# EAGLE design GLCD_Adapter (EAGLE 6.1)
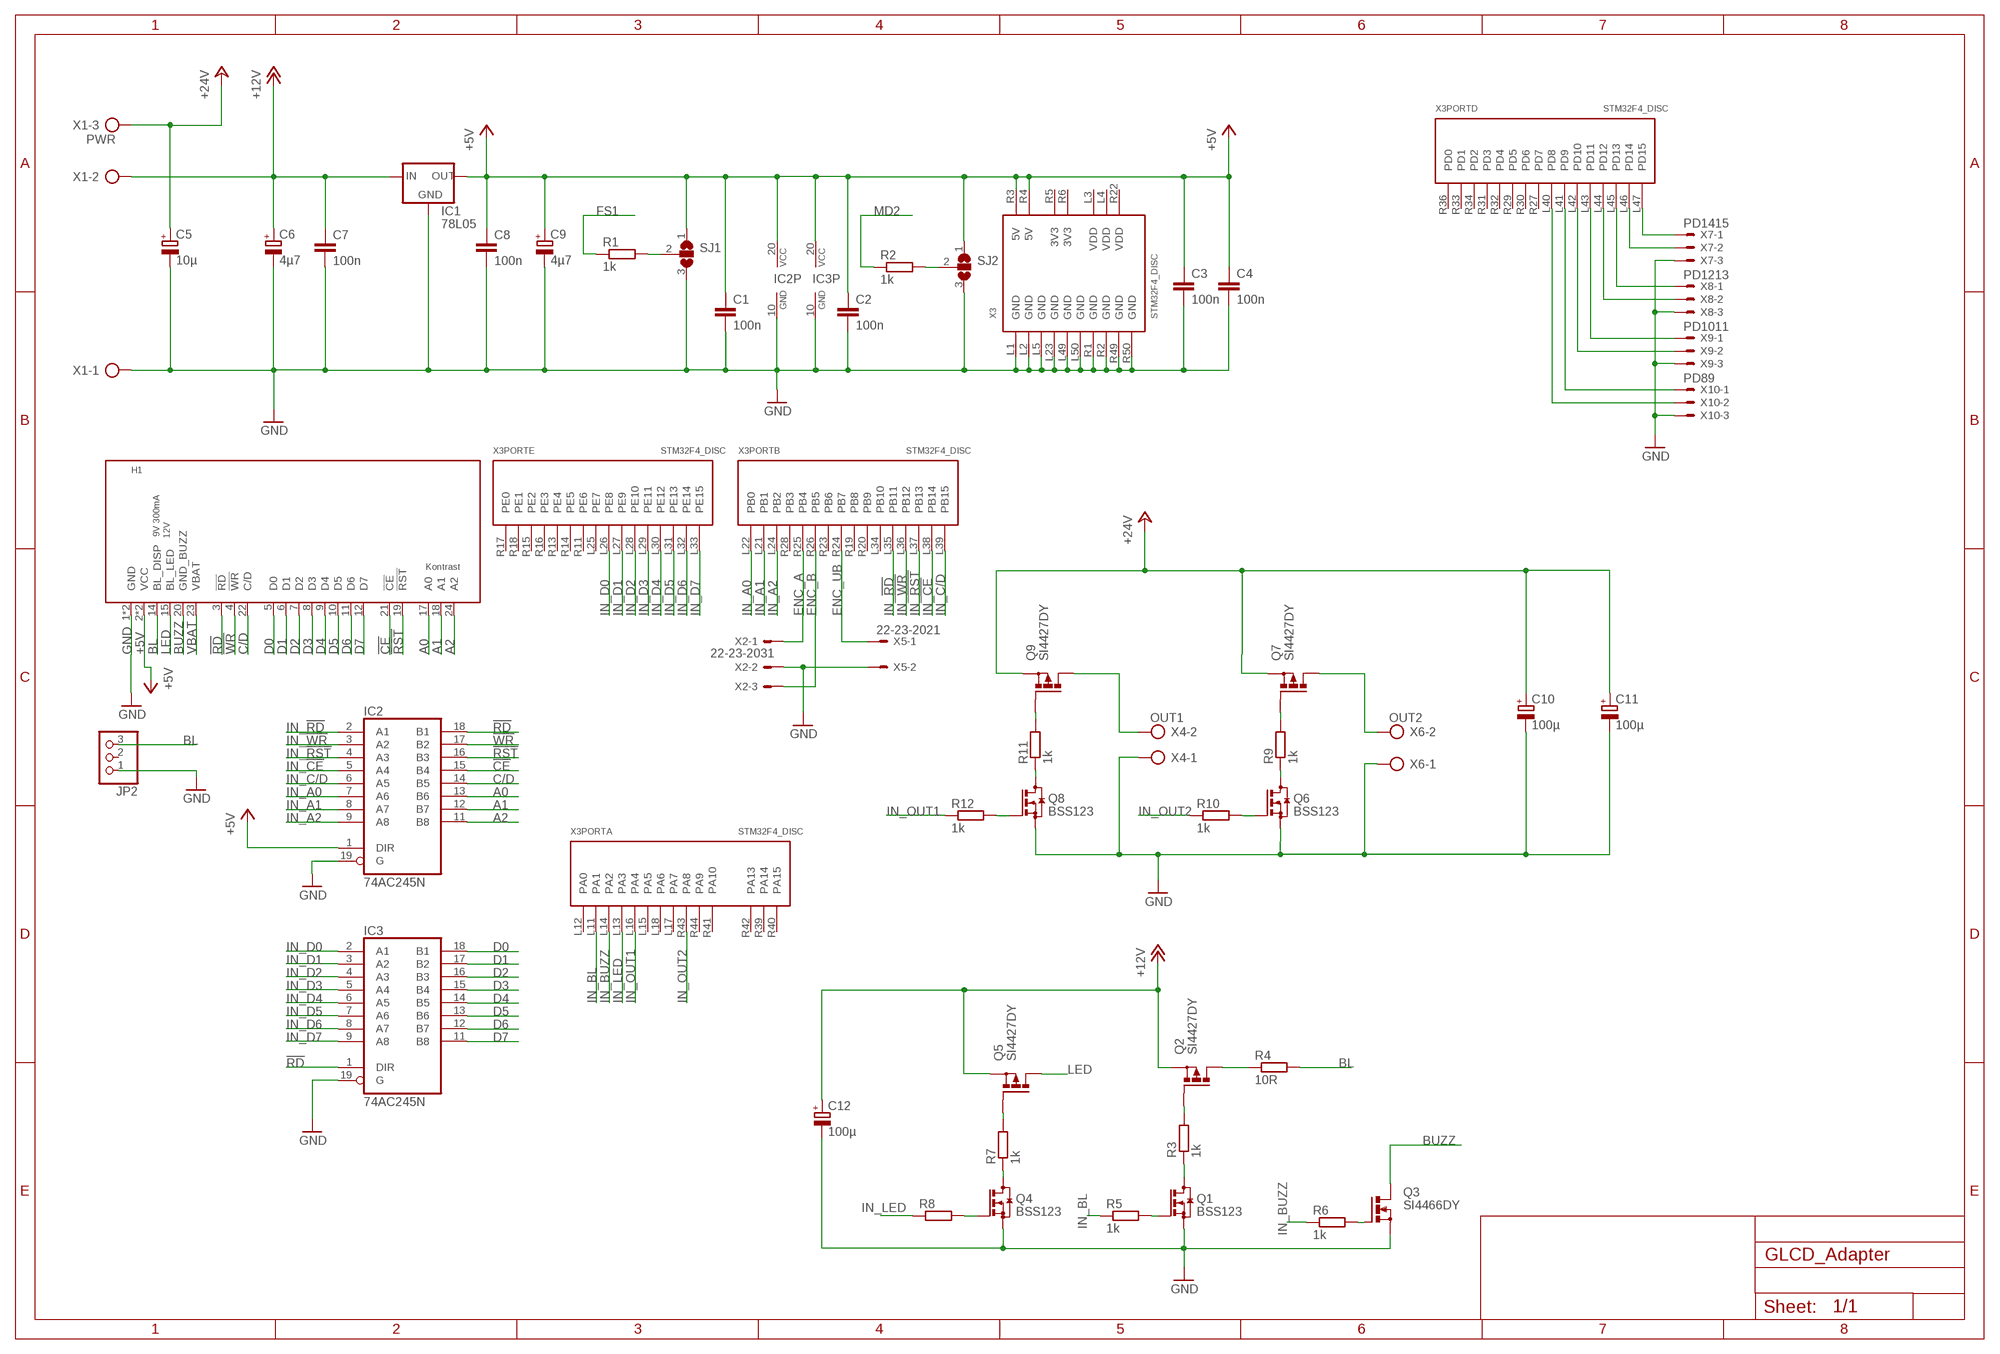
[diagram p0: schematic, sheet 1]

## Parts
C1  100n  C-EUC1206  [C1206]
C2  100n  C-EUC1206  [C1206]
C3  100n  C-EUC1206  [C1206]
C4  100n  C-EUC1206  [C1206]
C5  10µ  CPOL-EUE2-5  [E2-5]
C6  4µ7  CPOL-EUE2-5  [E2-5]
C7  100n  C-EUC1206  [C1206]
C8  100n  C-EUC1206  [C1206]
C9  4µ7  CPOL-EUE2-5  [E2-5]
C10  100µ  CPOL-EUE2-5  [E2-5]
C11  100µ  CPOL-EUE2-5  [E2-5]
C12  100µ  CPOL-EUE2-5  [E2-5]
H1  YL_24012-70-MICROMATCH  [YL24012-70-MICROMATCH]
IC1  78L05  78XXL  [78XXL]
IC2  74AC245N  [DIL20]
IC3  74AC245N  [DIL20]
JP2  PINHD-1X3  [1X03]
Q1  BSS123  [SOT23]
Q2  SI4427DY  P-MOSFET-SO8  [SO-08]
Q3  SI4466DY  N-MOSFET-SO8S  [SO-08]
Q4  BSS123  [SOT23]
Q5  SI4427DY  P-MOSFET-SO8  [SO-08]
Q6  BSS123  [SOT23]
Q7  SI4427DY  P-MOSFET-SO8  [SO-08]
Q8  BSS123  [SOT23]
Q9  SI4427DY  P-MOSFET-SO8  [SO-08]
R1  1k  R-EU_R1206  [R1206]
R2  1k  R-EU_R1206  [R1206]
R3  1k  R-EU_R1206  [R1206]
R4  10R  R-EU_0414/15  [0414/15]
R5  1k  R-EU_R1206  [R1206]
R6  1k  R-EU_R1206  [R1206]
R7  1k  R-EU_R1206  [R1206]
R8  R-EU_R1206  [R1206]
R9  1k  R-EU_R1206  [R1206]
R10  1k  R-EU_R1206  [R1206]
R11  1k  R-EU_R1206  [R1206]
R12  1k  R-EU_R1206  [R1206]
SJ1  SJ2WW  [SJ_2W]
SJ2  SJ2WW  [SJ_2W]
X1  PWR  AK500/3  [AK500/3]
X2  22-23-2031  [22-23-2031]
X3  STM32F4_DISC  [STM32F4_DISC]
X4  OUT1  AK500/2  [AK500/2]
X5  22-23-2021  [22-23-2021]
X6  OUT2  AK500/2  [AK500/2]
X7  PD1415  22-23-2031  [22-23-2031]
X8  PD1213  22-23-2031  [22-23-2031]
X9  PD1011  22-23-2031  [22-23-2031]
X10  PD89  22-23-2031  [22-23-2031]

## Nets
!CE: H1.21(!CE) IC2.15(B4)
!RD: H1.3(!RD) IC2.18(B1) IC3.1(DIR)
!RST: H1.19(!RST) IC2.16(B3)
!WR: H1.4(!WR) IC2.17(B2)
+5V: C1.1 C2.1 C3.1 C4.1 C8.1 C9.+ H1.2(VCC) H1.16(VCC) IC1.OUT IC2.1(DIR) IC2.20(VCC) IC3.20(VCC) SJ1.1 SJ2.1 X3.R3(5V) X3.R4(5V)
+12V: C6.+ C7.1 C12.+ IC1.IN Q2.1(S) Q2.2(S) Q2.3(S) Q5.1(S) Q5.2(S) Q5.3(S) X1.2
+24V: C5.+ C10.+ C11.+ Q7.1(S) Q7.2(S) Q7.3(S) Q9.1(S) Q9.2(S) Q9.3(S) X1.3
A0: H1.17(A0) IC2.13(B6)
A1: H1.18(A1) IC2.12(B7)
A2: H1.24(A2) IC2.11(B8)
BL: H1.14(BL_DISP) JP2.3 R4.2
BUZZ: H1.20(GND_BUZZ) Q3.5(D) Q3.6(D) Q3.7(D) Q3.8(D)
C/D: H1.22(C/D) IC2.14(B5)
D0: H1.5(D0) IC3.18(B1)
D1: H1.6(D1) IC3.17(B2)
D2: H1.7(D2) IC3.16(B3)
D3: H1.8(D3) IC3.15(B4)
D4: H1.9(D4) IC3.14(B5)
D5: H1.10(D5) IC3.13(B6)
D6: H1.11(D6) IC3.12(B7)
D7: H1.12(D7) IC3.11(B8)
ENC_A: X2.1 X3.R25(PB4)
ENC_B: X2.3 X3.R26(PB5)
ENC_UB: X3.R24(PB7) X5.1
FS1: R1.1
GND: C1.2 C2.2 C3.2 C4.2 C5.- C6.- C7.2 C8.2 C9.- C10.- C11.- C12.- H1.1(GND) H1.13(GND) IC1.GND IC2.10(GND) IC2.19(G) IC3.10(GND) IC3.19(G) JP2.1 Q1.2(S) Q3.1(S) Q3.2(S) Q3.3(S) Q4.2(S) Q6.2(S) Q8.2(S) SJ1.3 SJ2.3 X1.1 X2.2 X3.L1(GND) X3.L2(GND) X3.L5(GND) X3.L23(GND) X3.L49(GND) X3.L50(GND) X3.R1(GND) X3.R2(GND) X3.R49(GND) X3.R50(GND) X4.1 X5.2 X6.1 X7.3 X8.3 X9.3 X10.3
IN_!CE: IC2.5(A4) X3.L38(PB14)
IN_!RD: IC2.2(A1) X3.L35(PB11)
IN_!RST: IC2.4(A3) X3.L37(PB13)
IN_!WR: IC2.3(A2) X3.L36(PB12)
IN_A0: IC2.7(A6) X3.L22(PB0)
IN_A1: IC2.8(A7) X3.L21(PB1)
IN_A2: IC2.9(A8) X3.L24(PB2)
IN_BL: R5.1 X3.L11(PA1)
IN_BUZZ: R6.1 X3.L14(PA2)
IN_C/D: IC2.6(A5) X3.L39(PB15)
IN_D0: IC3.2(A1) X3.L26(PE8)
IN_D1: IC3.3(A2) X3.L27(PE9)
IN_D2: IC3.4(A3) X3.L28(PE10)
IN_D3: IC3.5(A4) X3.L29(PE11)
IN_D4: IC3.6(A5) X3.L30(PE12)
IN_D5: IC3.7(A6) X3.L31(PE13)
IN_D6: IC3.8(A7) X3.L32(PE14)
IN_D7: IC3.9(A8) X3.L33(PE15)
IN_LED: R8.1 X3.L13(PA3)
IN_OUT1: R12.1 X3.L16(PA4)
IN_OUT2: R10.1 X3.R43(PA8)
LED: H1.15(BL_LED) Q5.5(D) Q5.6(D) Q5.7(D) Q5.8(D)
LED1: Q7.5(D) Q7.6(D) Q7.7(D) Q7.8(D) X6.2
LED2: Q9.5(D) Q9.6(D) Q9.7(D) Q9.8(D) X4.2
MD2: R2.1
N$1: R1.2 SJ1.2
N$2: R2.2 SJ2.2
N$3: Q2.4(G) R3.2
N$4: Q1.3(D) R3.1
N$5: Q2.5(D) Q2.6(D) Q2.7(D) Q2.8(D) R4.1
N$6: Q1.1(G) R5.2
N$7: Q5.4(G) R7.2
N$8: Q3.4(G) R6.2
N$9: Q4.3(D) R7.1
N$10: Q7.4(G) R9.2
N$11: Q4.1(G) R8.2
N$12: Q6.3(D) R9.1
N$13: Q6.1(G) R10.2
N$14: Q9.4(G) R11.2
N$15: Q8.3(D) R11.1
N$16: Q8.1(G) R12.2
N$20: X3.L40(PD8) X10.2
N$21: X3.L41(PD9) X10.1
N$22: X3.L42(PD10) X9.2
N$23: X3.L43(PD11) X9.1
N$24: X3.L44(PD12) X8.2
N$25: X3.L45(PD13) X8.1
N$26: X3.L46(PD14) X7.2
N$27: X3.L47(PD15) X7.1
VBAT: H1.23(VBAT)
Unconnected: JP2.2 X3.L6(!RST) X3.L7(PC1) X3.L8(PC0) X3.L9(PC3) X3.L10(PC2) X3.L12(PA0) X3.L15(PA5) X3.L17(PA7) X3.L18(PA6) X3.L19(PC4) X3.L20(PC5) X3.L25(PE7) X3.L34(PB10) X3.L48(NC) X3.R7(PH0) X3.R8(PH1) X3.R9(PC14) X3.R10(PC15) X3.R11(PE6) X3.R12(PC13) X3.R13(PE4) X3.R14(PE5) X3.R15(PE2) X3.R16(PE3) X3.R17(PE0) X3.R18(PE1) X3.R19(PB8) X3.R20(PB9) X3.R21(BOOT0) X3.R23(PB6) X3.R27(PD7) X3.R28(PB3) X3.R29(PD5) X3.R30(PD6) X3.R31(PD3) X3.R32(PD4) X3.R33(PD1) X3.R34(PD2) X3.R35(PC12) X3.R36(PD0) X3.R37(PC10) X3.R38(PC11) X3.R39(PA14) X3.R40(PA15) X3.R41(PA10) X3.R42(PA13) X3.R44(PA9) X3.R45(PC8) X3.R46(PC9) X3.R47(PC6) X3.R48(PC7) X3.T1(JP2A) X3.T2(JP2B) X3.T3(JP3A) X3.T4(JP3B)

## Power pins joined to a net without a drawn wire
3V3: X3.R5(3V3) X3.R6(3V3)
VDD: X3.L3(VDD) X3.L4(VDD) X3.R22(VDD)

## Library data of the parts
C1-C4 C7 C8 = rcl:C-EU: CAPACITOR, European symbol
C5 C6 C9-C12 = rcl:CPOL-EU: POLARIZED CAPACITOR, European symbol
H1 = GLCD-YL240:YL_24012-70-MICROMATCH
IC1 = v-reg:78XXL: VOLTAGE REGULATOR
IC2 IC3 = 74xx-eu:74*245: Octal BUS TRANSCEIVER, 3-state
JP2 = pinhead:PINHD-1X3: PIN HEADER
Q1 Q4 Q6 Q8 = transistor-small-signal:BSS123: N-CHANNEL MOS FET
Q2 Q5 Q7 Q9 = transistor-power:P-MOSFET-SO8: P-Channel MOSFET Example: FDS4435A; P-Channel Logic Level PowerTrench® MOSFET FDS4465; P-Channel 1.8V Specified PowerTrench® MOSFET Source: www.fairchildsemi.com
Q3 = transistor-power:N-MOSFET-SO8: N-Channel MOSFET Example: FDS7760A; N-Channel Logic Level PowerTrench® MOSFET FDS2572; N-Channel UltraFET® Trench MOSFET Source: www.fairchildsemi.com
R1-R12 = rcl:R-EU_: RESISTOR, European symbol
SJ1 SJ2 = jumper:SJ2W: SMD solder JUMPER
X1 = con-ptr500:AK500/3: CONNECTOR; OC_FARNELL: unknown; OC_NEWARK: unknown
X2 X7-X10 = con-molex:22-23-2031: .100" (2.54mm) Center Header - 3 Pin; MF: MOLEX; MPN: 22-23-2031; OC_FARNELL: 1462950; OC_NEWARK: 30C0862
X3 = stm32f4_disc:STM32F4_DISC: STM32F4 Discovery Board
X4 X6 = con-ptr500:AK500/2: CONNECTOR; OC_FARNELL: unknown; OC_NEWARK: unknown
X5 = con-molex:22-23-2021: .100" (2.54mm) Center Header - 2 Pin; MF: MOLEX; MPN: 22-23-2021; OC_FARNELL: 1462926; OC_NEWARK: 25C3832

## Board
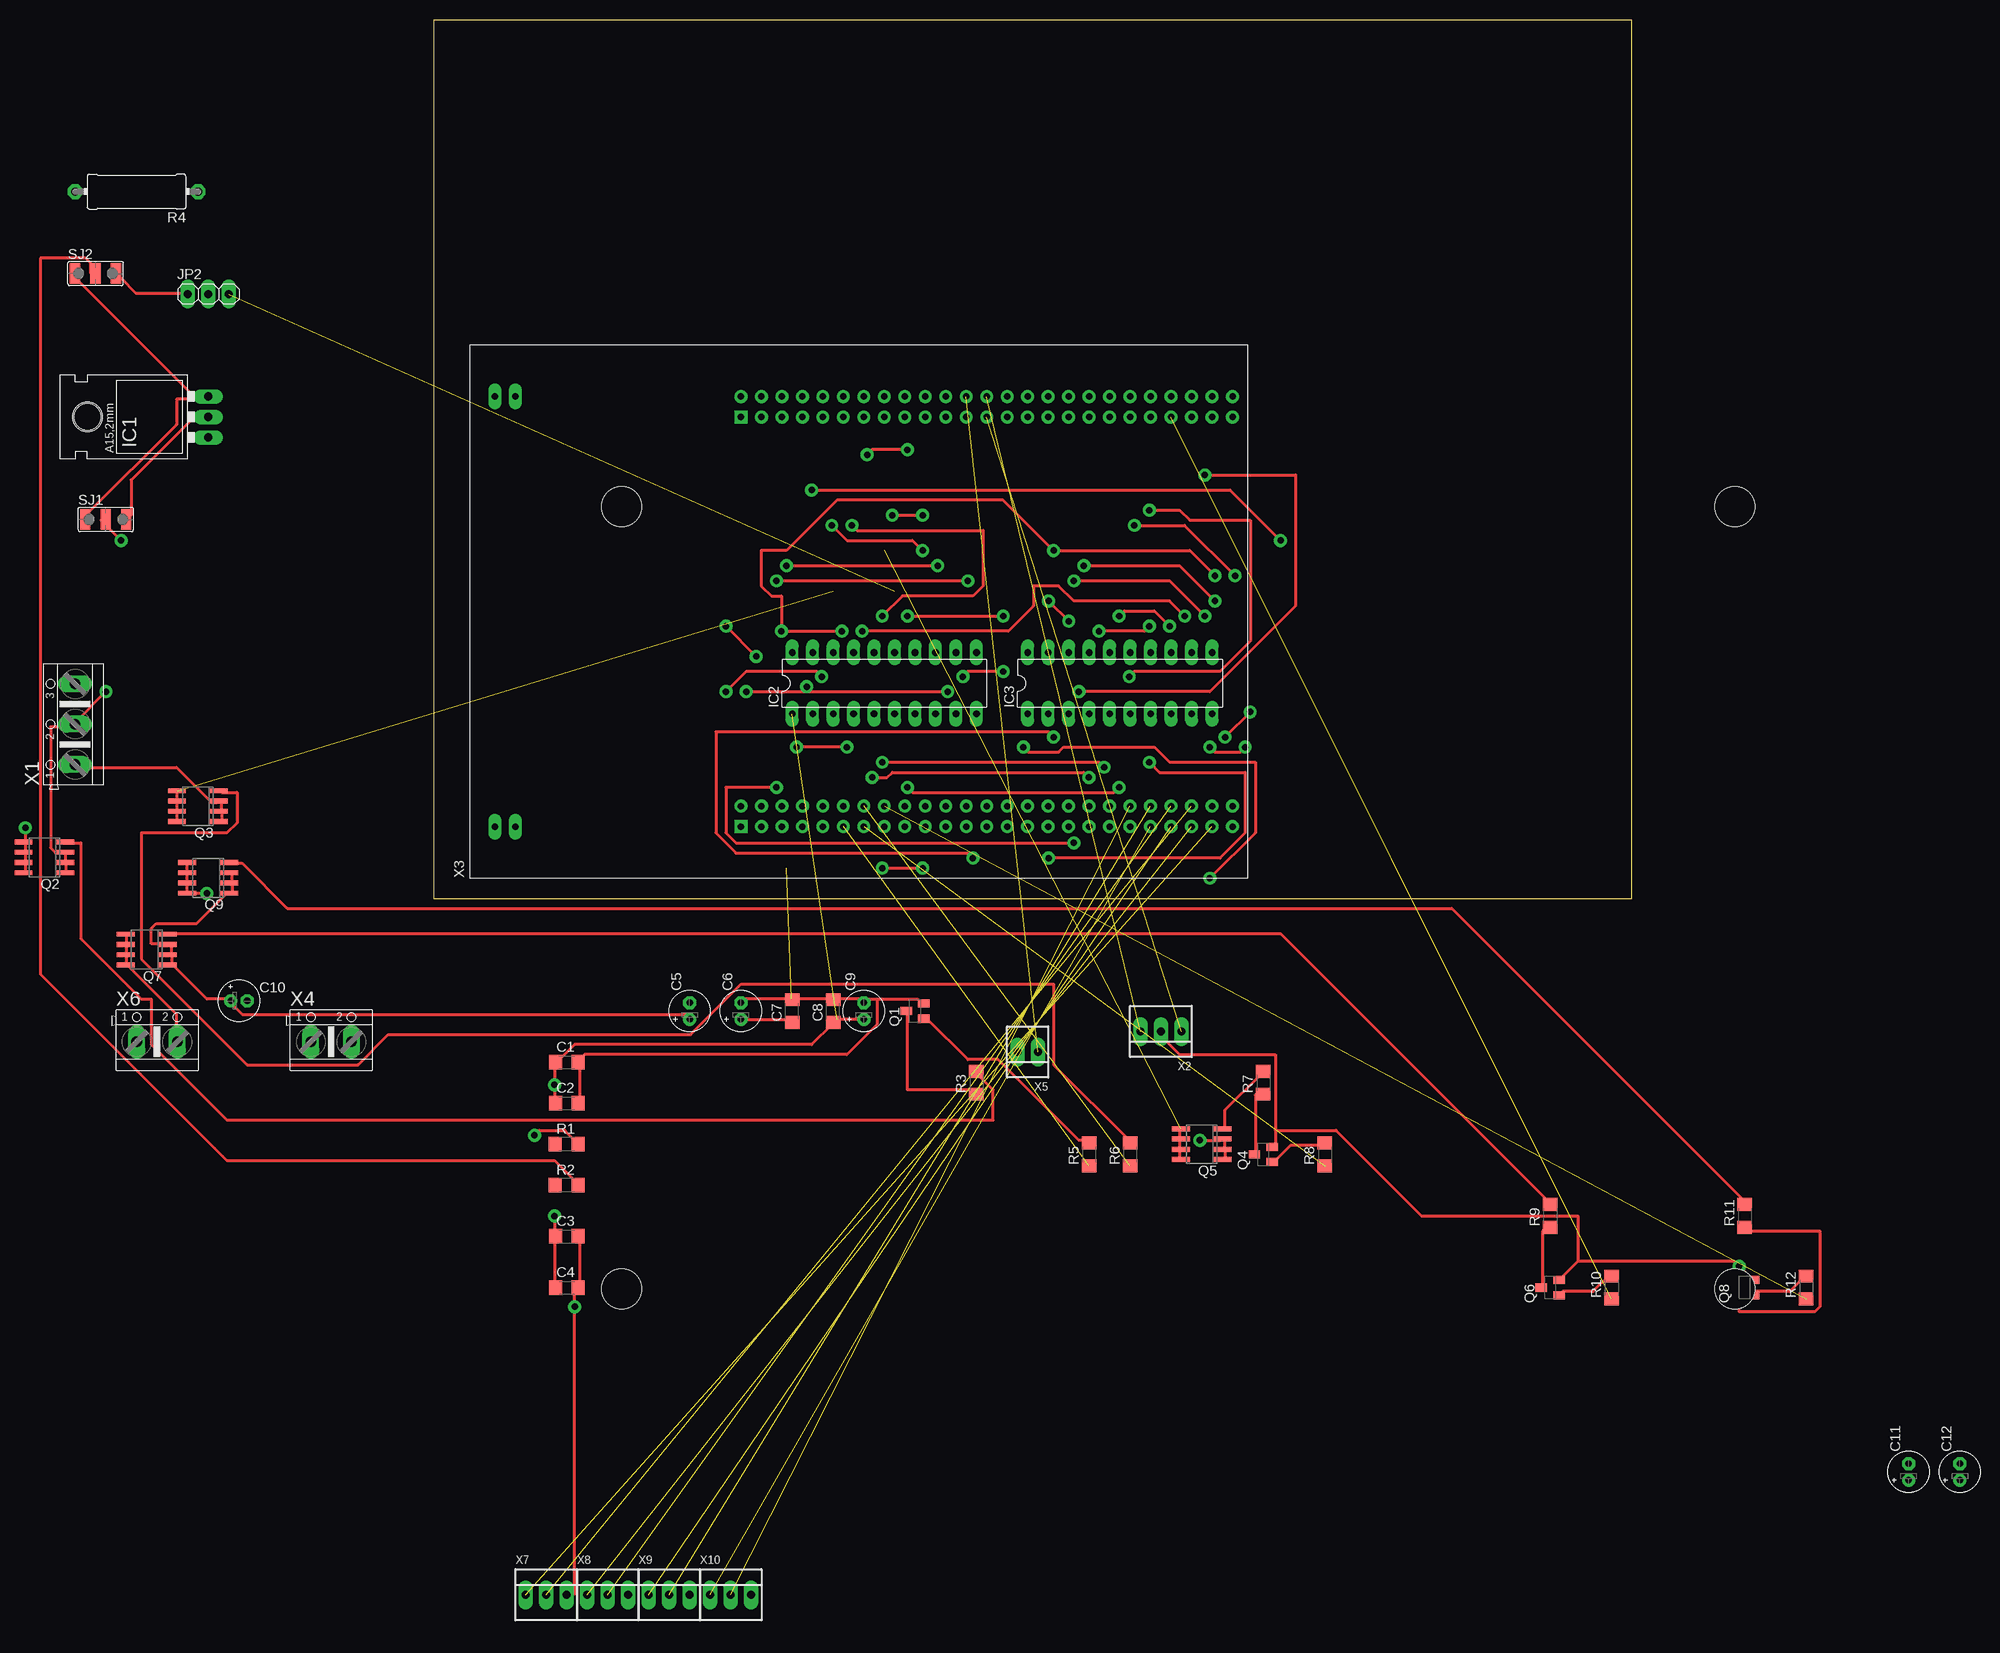
[diagram p1: board, top side]
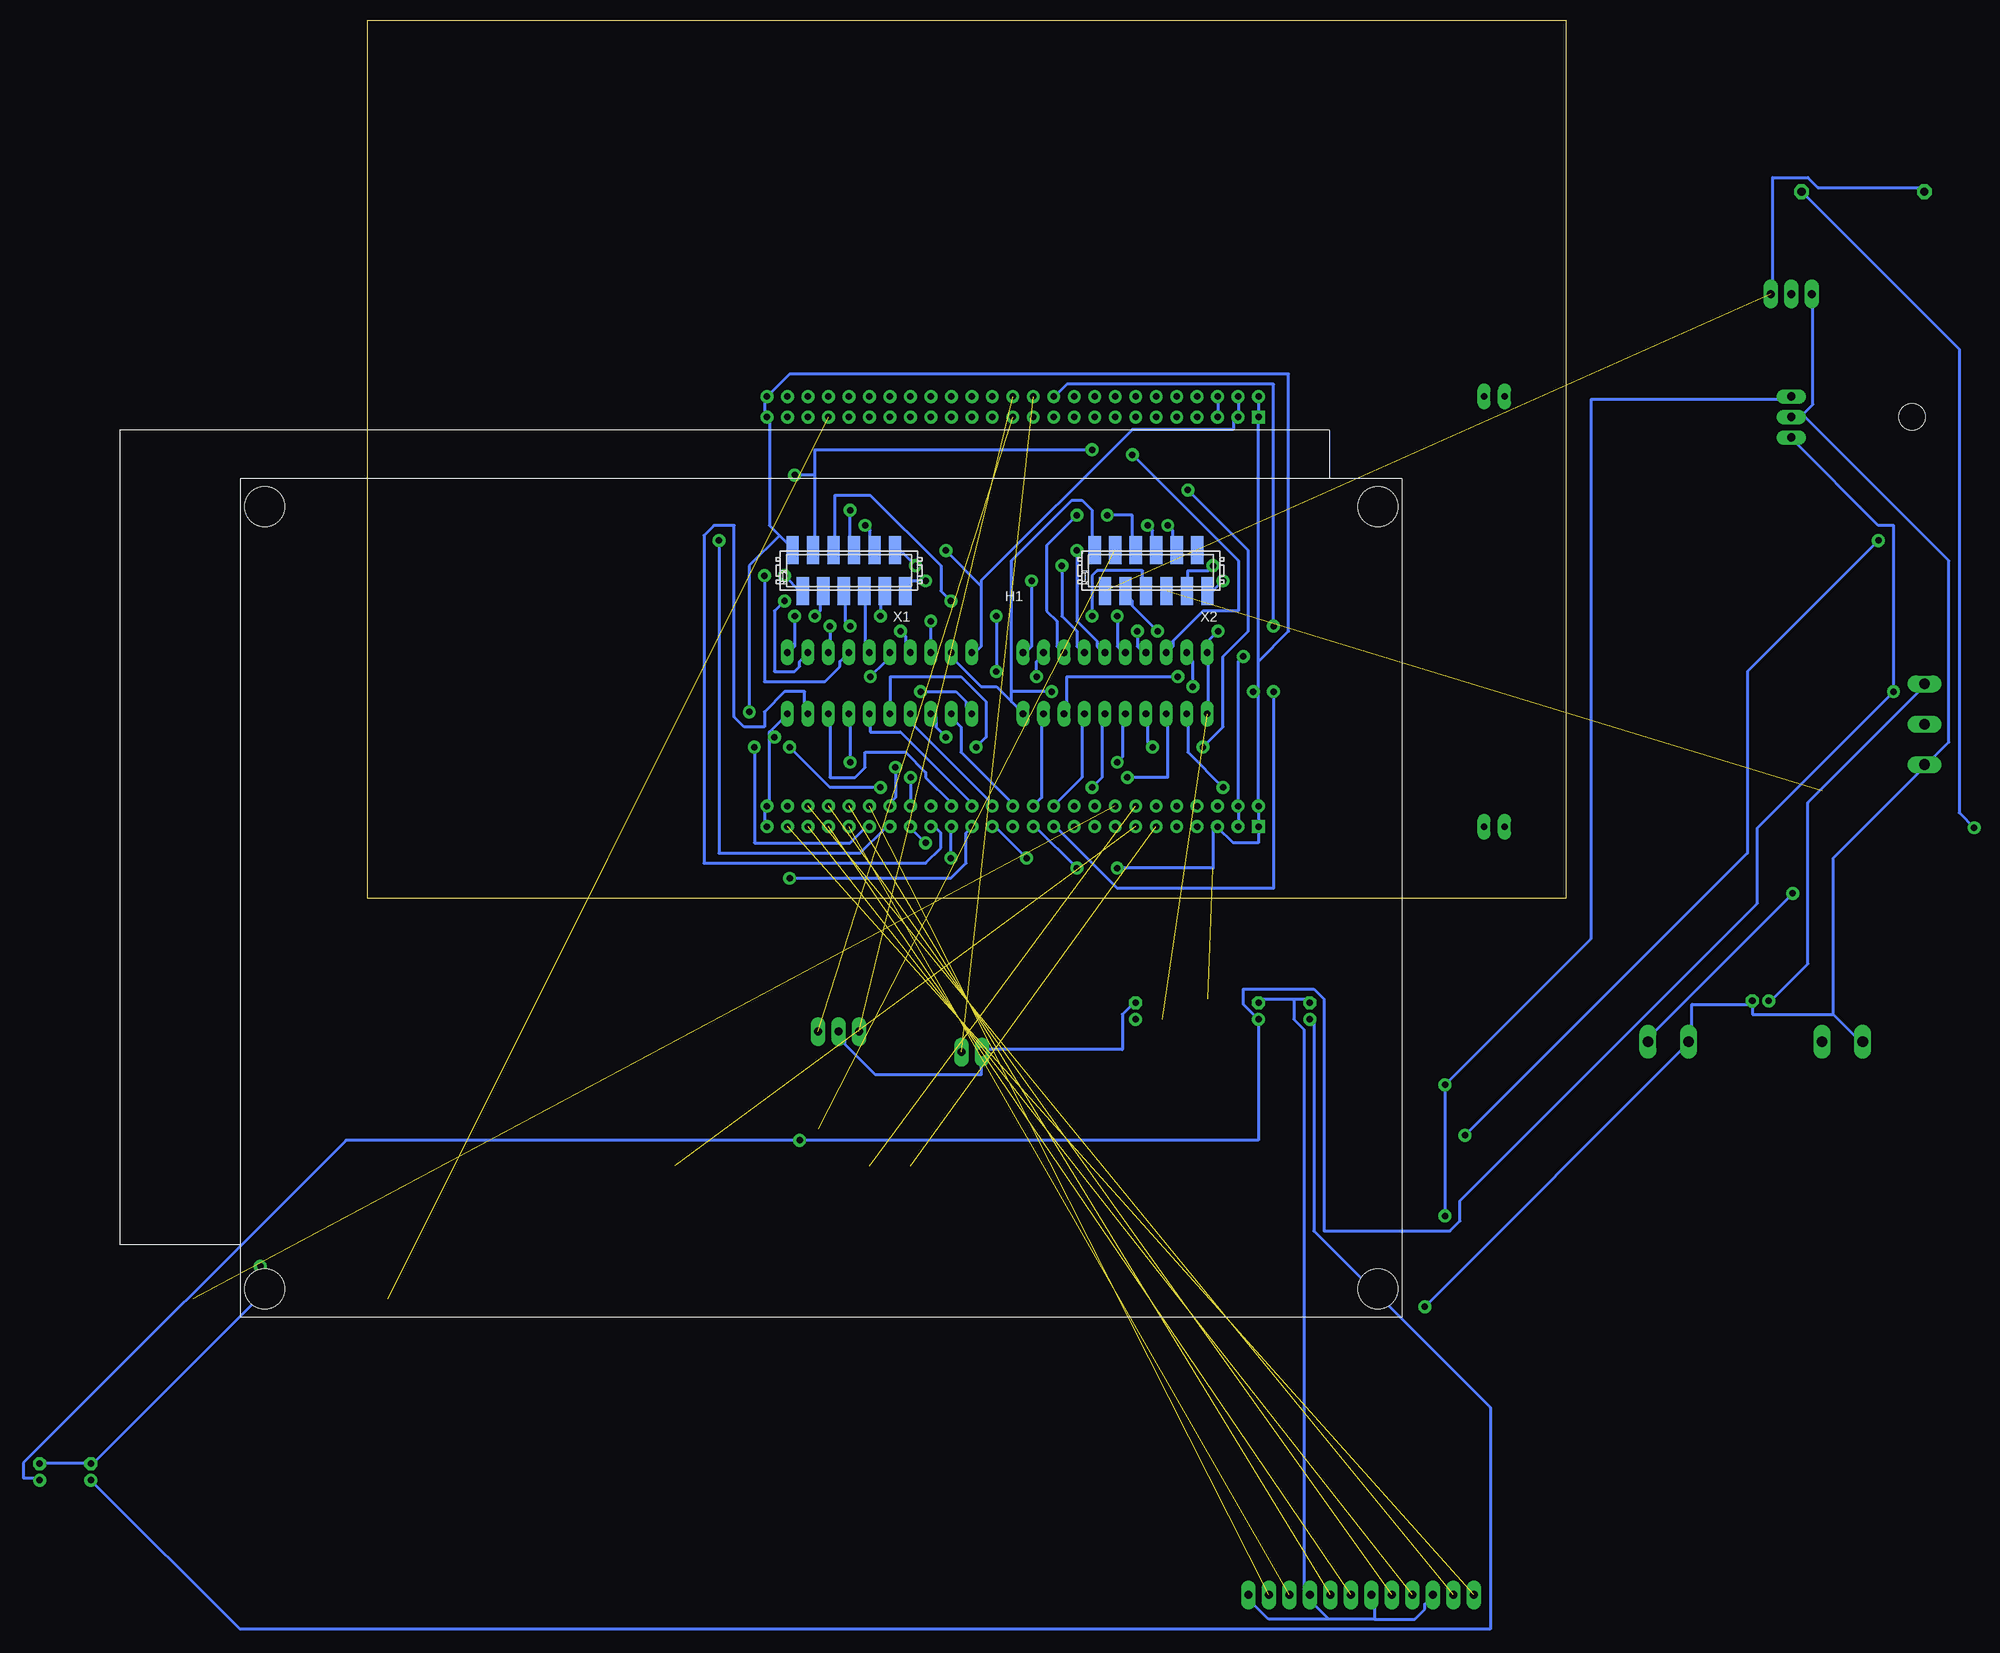
[diagram p2: board, bottom side, seen from below]

Size 148.57 x 108.89 mm. Coordinates in mm from the lower left corner, seen from the top.
Outline: 0,0 148.57,0 148.57,108.89 0,108.89 0,0
Copper layers (1*16): Top 0.035mm / dielectric 1.5mm / Bottom 0.035mm
Design rules: minimum track width 0.4mm, minimum drill 0.8mm, track to track 0.4mm, track to pad 0.4mm, pad to pad 0.4mm, via to via 0.4mm, smd to smd 8mil, copper to edge 40mil, drill to drill 8mil, minimum pad ring 0.4mm, minimum via ring 0.4mm, stop-mask expansion 4mil, vias tented up to drill 0mil, thermal gap 10mil
tKeepout: area 43.2,29.2 to 68.6,31.8; area 72.4,29.2 to 97.8,31.8; area 72.4,21.6 to 97.8,24.1; area 43.2,21.6 to 68.6,24.1; area 37.5,8.3 to 99.7,12.1; area 37.5,59.1 to 99.7,62.9
tRestrict: area 37.5,59.1 to 99.7,62.9; area 43.2,29.2 to 68.6,31.8; area 72.4,29.2 to 97.8,31.8; area 72.4,21.6 to 97.8,24.1; area 43.2,21.6 to 68.6,24.1; area 37.5,8.3 to 99.7,12.1

### Footprints (pad centres in the part's own frame; a part is rotated, then mirrored left to right if it is on the bottom)
C1206 = smd 1.6 x 1.8: 1 -1.4,0; 2 1.4,0
E2-5 = drill 0.813 pad 1.27: + -1.016,0 | drill 0.813 pad 1.27 octagon: - 1.016,0
YL24012-70-MICROMATCH = smd 1.5 x 3.5: 1 75.565,8.89; 2 74.295,13.97; 3 73.025,8.89; 4 71.755,13.97; 5 70.485,8.89; 6 69.215,13.97; 7 67.945,8.89; 8 66.675,13.97; 9 65.405,8.89; 10 64.135,13.97; 11 62.865,8.89; 12 61.595,13.97; 13 38.1,8.89; 14 36.83,13.97; 15 35.56,8.89; 16 34.29,13.97; 17 33.02,8.89; 18 31.75,13.97; 19 30.48,8.89; 20 29.21,13.97; 21 27.94,8.89; 22 26.67,13.97; 23 25.4,8.89; 24 24.13,13.97 | hole 5: 3,3.5; 3,100.5; 141,100.5; 141,3.5; 3,3.5; 3,100.5; 141,100.5; 141,3.5
78XXL = drill 1.016 long: GND 0,-3.81; IN -2.54,-3.81; OUT 2.54,-3.81 | hole 3.302: 0,11.176
DIL20 = drill 0.813 long: 1 -11.43,-3.81; 2 -8.89,-3.81; 3 -6.35,-3.81; 4 -3.81,-3.81; 5 -1.27,-3.81; 6 1.27,-3.81; 7 3.81,-3.81; 8 6.35,-3.81; 9 8.89,-3.81; 10 11.43,-3.81; 11 11.43,3.81; 12 8.89,3.81; 13 6.35,3.81; 14 3.81,3.81; 15 1.27,3.81; 16 -1.27,3.81; 17 -3.81,3.81; 18 -6.35,3.81; 19 -8.89,3.81; 20 -11.43,3.81
1X03 = drill 1.016 long: 1 -2.54,0; 2 0,0; 3 2.54,0
SOT23 = smd 1 x 1.4: 1 -0.95,-1.1; 2 0.95,-1.1; 3 0,1.1
SO-08 = smd 0.6 x 2.2: 1 -1.905,-2.6; 2 -0.635,-2.6; 3 0.635,-2.6; 4 1.905,-2.6; 5 1.905,2.6; 6 0.635,2.6; 7 -0.635,2.6; 8 -1.905,2.6
R1206 = smd 1.6 x 1.803: 1 -1.422,0; 2 1.422,0
0414/15 = drill 1.016 octagon: 1 -7.62,0; 2 7.62,0
SJ_2W = smd 1.27 x 2.54: 1 -2.54,0; 2 0,0; 3 2.54,0
AK500/3 = drill 1.321 long: 1 -5.004,0; 2 0,0; 3 5.004,0
22-23-2031 = drill 1 long: 1 -2.54,0; 2 0,0; 3 2.54,0
STM32F4_DISC = drill 0.8 square: L1 -27.94,30.48; R1 22.86,30.48 | drill 0.8: L2 -25.4,30.48; L3 -27.94,27.94; L4 -25.4,27.94; L5 -27.94,25.4; L6 -25.4,25.4; L7 -27.94,22.86; L8 -25.4,22.86; L9 -27.94,20.32; L10 -25.4,20.32; L11 -27.94,17.78; L12 -25.4,17.78; L13 -27.94,15.24; L14 -25.4,15.24; L15 -27.94,12.7; L16 -25.4,12.7; L17 -27.94,10.16; L18 -25.4,10.16; L19 -27.94,7.62; L20 -25.4,7.62; L21 -27.94,5.08; L22 -25.4,5.08; L23 -27.94,2.54; L24 -25.4,2.54; L25 -27.94,0; L26 -25.4,0; L27 -27.94,-2.54; L28 -25.4,-2.54; L29 -27.94,-5.08; L30 -25.4,-5.08; L31 -27.94,-7.62; L32 -25.4,-7.62; L33 -27.94,-10.16; L34 -25.4,-10.16; L35 -27.94,-12.7; L36 -25.4,-12.7; L37 -27.94,-15.24; L38 -25.4,-15.24; L39 -27.94,-17.78; L40 -25.4,-17.78; L41 -27.94,-20.32; L42 -25.4,-20.32; L43 -27.94,-22.86; L44 -25.4,-22.86; L45 -27.94,-25.4; L46 -25.4,-25.4; L47 -27.94,-27.94; L48 -25.4,-27.94; L49 -27.94,-30.48; L50 -25.4,-30.48; R2 25.4,30.48; R3 22.86,27.94; R4 25.4,27.94; R5 22.86,25.4; R6 25.4,25.4; R7 22.86,22.86; R8 25.4,22.86; R9 22.86,20.32; R10 25.4,20.32; R11 22.86,17.78; R12 25.4,17.78; R13 22.86,15.24; R14 25.4,15.24; R15 22.86,12.7; R16 25.4,12.7; R17 22.86,10.16; R18 25.4,10.16; R19 22.86,7.62; R20 25.4,7.62; R21 22.86,5.08; R22 25.4,5.08; R23 22.86,2.54; R24 25.4,2.54; R25 22.86,0; R26 25.4,0; R27 22.86,-2.54; R28 25.4,-2.54; R29 22.86,-5.08; R30 25.4,-5.08; R31 22.86,-7.62; R32 25.4,-7.62; R33 22.86,-10.16; R34 25.4,-10.16; R35 22.86,-12.7; R36 25.4,-12.7; R37 22.86,-15.24; R38 25.4,-15.24; R39 22.86,-17.78; R40 25.4,-17.78; R41 22.86,-20.32; R42 25.4,-20.32; R43 22.86,-22.86; R44 25.4,-22.86; R45 22.86,-25.4; R46 25.4,-25.4; R47 22.86,-27.94; R48 25.4,-27.94; R49 22.86,-30.48; R50 25.4,-30.48 | drill 0.8 long: T1 -27.94,60.96; T2 -27.94,58.42; T3 25.4,60.96; T4 25.4,58.42
AK500/2 = drill 1.321 long: 1 -2.515,0; 2 2.515,0
22-23-2021 = drill 1 long: 1 -1.27,0; 2 1.27,0

### Placement (x,y rotation side)
C1  16.51,-20.32 0 top  (outside the outline)
C2  16.51,-25.4 0 top  (outside the outline)
C3  16.51,-41.91 0 top  (outside the outline)
C4  16.51,-48.26 0 top  (outside the outline)
C5  31.75,-13.97 90 top  (outside the outline)
C6  38.1,-13.97 90 top  (outside the outline)
C7  44.45,-13.97 90 top  (outside the outline)
C8  49.53,-13.97 90 top  (outside the outline)
C9  53.34,-13.97 90 top  (outside the outline)
C10  -24.13,-12.7 0 top  (outside the outline)
C11  182.88,-71.12 90 top  (outside the outline)
C12  189.23,-71.12 90 top  (outside the outline)
H1  20.32,52.07 180 bottom
IC1  -31.75,59.69 90 top  (outside the outline)
IC2  55.88,26.67 0 top
IC3  85.09,26.67 0 top
JP2  -27.94,74.93 0 top  (outside the outline)
Q1  59.69,-13.97 90 top  (outside the outline)
Q2  -48.26,5.08 90 top  (outside the outline)
Q3  -29.21,11.43 90 top  (outside the outline)
Q4  102.87,-31.75 90 top  (outside the outline)
Q5  95.25,-30.48 90 top  (outside the outline)
Q6  138.43,-48.26 90 top  (outside the outline)
Q7  -35.56,-6.35 90 top  (outside the outline)
Q8  162.56,-48.26 90 top  (outside the outline)
Q9  -27.94,2.54 90 top  (outside the outline)
R1  16.51,-30.48 0 top  (outside the outline)
R2  16.51,-35.56 0 top  (outside the outline)
R3  67.31,-22.86 90 top  (outside the outline)
R4  -36.83,87.63 180 top  (outside the outline)
R5  81.28,-31.75 90 top  (outside the outline)
R6  86.36,-31.75 90 top  (outside the outline)
R7  102.87,-22.86 90 top  (outside the outline)
R8  110.49,-31.75 90 top  (outside the outline)
R9  138.43,-39.37 90 top  (outside the outline)
R10  146.05,-48.26 90 top  (outside the outline)
R11  162.56,-39.37 90 top  (outside the outline)
R12  170.18,-48.26 90 top  (outside the outline)
SJ1  -40.64,46.99 0 top  (outside the outline)
SJ2  -41.91,77.47 0 top  (outside the outline)
X1  -44.45,21.59 90 top  (outside the outline)
X2  90.17,-16.51 180 top  (outside the outline)
X3  68.58,36.83 90 top
X4  -12.7,-17.78 0 top  (outside the outline)
X5  73.66,-19.05 180 top  (outside the outline)
X6  -34.29,-17.78 0 top  (outside the outline)
X7  13.97,-86.36 0 top  (outside the outline)
X8  21.59,-86.36 0 top  (outside the outline)
X9  29.21,-86.36 0 top  (outside the outline)
X10  36.83,-86.36 0 top  (outside the outline)

### Tracks (layer width: path | path; a pad name or v marks a point on that pad's centre or on a via)
3V3
  Bottom 0.4: X3.R5 43.12,60 43.12,61.88 X3.R6
!CE  (via drill 0.8)
  Top 0.4: v60.62,43.12 59.38,44.38 51.25,44.38 v49.38,46.25
  Bottom 0.4: v60.62,43.12 60.62,34.38 58.12,31.88 58.12,31.25 57.5,30.62 IC2.15 | v49.38,46.25 48.75,45.62 48.75,43.75 H1.21
!RD  (via drill 0.8)
  Top 0.4: v53.75,55 54.38,55.62 v58.75,55.62 | v80,25.62 96.25,25.62 106.88,36.25 106.88,52.5 v95.62,52.5
  Bottom 0.4: v53.75,55 40.62,41.88 40.62,35.62 45,35.62 48.75,31.88 48.75,31.25 49.38,30.62 IC2.18 | v58.75,55.62 93.12,55.62 93.12,52.5 | 93.12,52.5 93.12,43.75 H1.3 | v80,25.62 75.62,25.62 74.38,24.38 74.38,23.75 73.75,23.12 IC3.1 | 93.12,52.5 v95.62,52.5
!RST  (via drill 0.8)
  Top 0.4: v55.62,35 58.12,37.5 66.88,37.5 68.12,38.75 68.12,45.62 52.5,45.62 v51.88,46.25
  Bottom 0.4: v55.62,35 55.62,31.25 55,30.62 IC2.16 | v51.88,46.25 51.25,45.62 51.25,43.75 H1.19
!WR  (via drill 0.8)
  Top 0.4: v53.12,33.12 71.25,33.12 74.38,36.25 74.38,38.75 77.5,38.75 79.38,36.88 91.25,36.88 v93.12,35
  Bottom 0.4: v53.12,33.12 53.12,31.25 52.5,30.62 IC2.17 | v93.12,35 92.5,35.62 92.5,37.5 H1.4
+5V  (via drill 0.8)  (1 unrouted)
  Top 0.4: v50.62,33.12 v43.12,33.12 43.12,37.5 41.88,37.5 40.62,38.75 40.62,43.12 43.75,43.12 50,49.38 70.62,49.38 v76.88,43.12 93.75,43.12 v96.88,40 | -29.38,61.88 -28.12,61.88 IC1.OUT -29.38,61.88 | -29.38,61.88 -31.88,61.88 -31.88,58.75 -43.12,47.5 SJ1.1 | -29.38,61.88 -44.38,76.88 SJ2.1 | C4.1 15,-48.12 15,-42.5 C3.1 15,-41.88 v15,-39.38 | C2.1 15,-25 v15,-23.12 15,-20.62 C1.1 15.62,-20 17.5,-18.12 46.88,-18.12 49.38,-15.62 C8.1 50,-15 53.12,-15 C9.+
  Bottom 0.4: IC2.1 44.38,23.12 44.38,30 IC2.20 44.38,30.62 44.38,31.88 v43.12,33.12 | v50.62,33.12 53.75,36.25 53.75,36.88 54.38,37.5 H1.16 | IC3.20 73.75,30.62 IC3.20 | X3.R4 40.62,61.88 40.62,60 X3.R3 41.25,59.38 41.25,58.12 53.75,58.12 72.5,39.38 72.5,38.75 | 72.5,38.75 72.5,31.25 73.12,30.62 IC3.20 | v96.88,40 95,38.12 H1.2 | 72.5,38.75 v76.88,43.12 | v15,-39.38 v15,-23.12 -3.12,-5 -3.12,61.88 -27.5,61.88 IC1.OUT
+12V  (via drill 0.8)
  Top 0.4: -45.62,4.38 -45.62,3.12 Q2.1 | -45.62,4.38 Q2.2 -45.62,4.38 | -45.62,4.38 -45.62,5.62 Q2.3 -46.25,5.62 -46.88,5.62 -47.5,6.25 -47.5,21.25 -45,21.25 X1.2 -44.38,21.88 v-40.62,25.62 | 98.12,-31.25 98.12,-32.5 Q5.1 | 98.12,-31.25 Q5.2 98.12,-31.25 | 98.12,-31.25 98.12,-30 Q5.3 97.5,-30 v95,-30 | C7.1 44.38,-15 38.12,-15 C6.+
  Bottom 0.4: IC1.IN -28.12,56.88 -38.75,46.25 -40.62,46.25 v-40.62,25.62 -23.75,8.75 -23.75,-0.62 13.12,-37.5 13.12,-40 14.38,-41.25 30,-41.25 30,-12.5 31.25,-11.25 40,-11.25 40,-13.12 38.12,-15 | 38.12,-15 38.12,-30 v95,-30 151.25,-30 191.25,-70 191.25,-71.88 189.38,-71.88 C12.+ | 38.12,-15 C6.+ 38.12,-15
+24V
  Top 0.4: -25,1.88 -25,0.62 Q9.1 -25.62,0.62 -29.38,-3.12 -34.38,-3.12 -35,-3.75 -35,-5.62 -33.12,-5.62 Q7.3 -32.5,-5.62 -32.5,-6.88 | -25,1.88 Q9.2 -25,1.88 | -25,1.88 -25,3.12 Q9.3 | -32.5,-6.88 -32.5,-8.12 | -32.5,-8.12 Q7.1 -32.5,-8.12 | -32.5,-6.88 Q7.2 -32.5,-6.88 | -32.5,-8.12 -28.12,-12.5 -25.62,-12.5 C10.+ -25,-13.12 -23.75,-14.38 31.25,-14.38 C5.+
  Bottom 0.4: C11.+ 182.5,-72.5 164.38,-90.62 9.38,-90.62 9.38,-63.12 31.25,-41.25 31.25,-15 C5.+ | X1.3 -44.38,26.25 -30,11.88 -30,-8.12 -25.62,-12.5 C10.+
A0  (via drill 0.8)
  Top 0.4: v56.88,47.5 v60.62,47.5
  Bottom 0.4: v60.62,47.5 64.38,43.75 64.38,35.62 63.12,34.38 63.12,31.25 62.5,30.62 IC2.13 | v56.88,47.5 53.75,47.5 53.75,43.75 H1.17
A1  (via drill 0.8)
  Top 0.4: v65.62,27.5 66.25,28.12 v70.62,28.12 | v58.75,35 v70.62,35
  Bottom 0.4: v65.62,27.5 65.62,29.38 65,30 IC2.12 | v70.62,35 v70.62,28.12 | v58.75,35 58.75,40 58.12,40.62 52.5,40.62 52.5,38.12 H1.18
A2  (via drill 0.8)
  Top 0.4: v42.5,39.38 v66.25,39.38
  Bottom 0.4: v66.25,39.38 66.25,31.25 66.88,30.62 IC2.11 | v42.5,39.38 44.38,37.5 H1.24
BL  (1 unrouted)
  Bottom 0.4: R4.2 -44.38,88.12 -31.25,88.12 -30,89.38 -25.62,89.38 -25.62,75 JP2.3
BUZZ  (1 unrouted)
  Top 0.4: -31.88,10.62 -31.88,9.38 Q3.8 | -31.88,10.62 Q3.7 -31.88,10.62 | -31.88,11.88 -31.88,13.12 Q3.5 | -31.88,11.88 Q3.6 -31.88,11.88 | -31.88,11.88 -31.88,10.62
C/D  (via drill 0.8)
  Top 0.4: v43.75,41.25 v62.5,41.25
  Bottom 0.4: v62.5,41.25 62.5,35 60.62,33.12 60.62,31.25 60,30.62 IC2.14 | v43.75,41.25 44.38,40.62 46.88,40.62 46.88,38.12 H1.22
D0  (via drill 0.8)
  Top 0.4: v76.25,36.88 v78.75,34.38
  Bottom 0.4: v78.75,34.38 78.75,30.62 IC3.18 | v76.25,36.88 77.5,38.12 77.5,41.25 86.25,50 90.62,50 90.62,43.75 H1.5
D1  (via drill 0.8)
  Top 0.4: v82.5,33.12 88.12,33.12 v88.75,33.75
  Bottom 0.4: v82.5,33.12 81.88,32.5 81.88,30.62 IC3.17 | v88.75,33.75 89.38,34.38 89.38,37.5 H1.6
D2  (via drill 0.8)
  Top 0.4: v86.25,27.5 86.88,28.12 97.5,28.12 101.25,31.88 101.25,46.88 93.75,46.88 92.5,48.12 v88.75,48.12
  Bottom 0.4: v86.25,27.5 84.38,29.38 84.38,30 IC3.16 | v88.75,48.12 88.75,43.75 H1.7
D3
  Bottom 0.4: IC3.15 86.88,30.62 86.88,37.5 H1.8
D4  (via drill 0.8)
  Top 0.4: v99.38,40 93.12,46.25 v86.88,46.25
  Bottom 0.4: v99.38,40 99.38,26.88 91.88,26.88 90,28.75 90,29.38 89.38,30 IC3.14 | v86.88,46.25 86.25,45.62 86.25,43.75 H1.9
D5  (via drill 0.8)
  Top 0.4: v91.25,33.75 89.38,35.62 85.62,35.62 v85,35
  Bottom 0.4: v91.25,33.75 91.25,30.62 IC3.13 | v85,35 85,37.5 H1.10
D6  (via drill 0.8)
  Top 0.4: v96.88,36.88 92.5,41.25 v80.62,41.25
  Bottom 0.4: v96.88,36.88 98.12,35.62 98.12,28.12 95.62,28.12 95,28.75 95,29.38 94.38,30 IC3.12 | v80.62,41.25 83.12,43.75 H1.11
D7  (via drill 0.8)
  Top 0.4: v95.62,35 91.25,39.38 v79.38,39.38
  Bottom 0.4: v95.62,35 95.62,31.25 96.25,30.62 IC3.11 | v79.38,39.38 81.88,39.38 81.88,38.12 H1.12
ENC_A  (1 unrouted)
ENC_B  (1 unrouted)
ENC_UB  (1 unrouted)
GND  (via drill 0.8)  (1 unrouted)
  Top 0.4: v101.25,23.12 v98.12,20 | v55.62,3.75 v60.62,3.75 | 45.62,25.62 v46.25,26.25 | v38.75,25.62 45.62,25.62 | 45.62,25.62 v63.75,25.62 | SJ2.3 -38.75,76.88 -36.88,75 -30.62,75 JP2.1 | SJ1.3 -37.5,47.5 -37.5,51.88 -30,59.38 -28.12,59.38 IC1.GND | -26.25,10.62 -26.25,9.38 Q3.1 | -26.25,10.62 Q3.2 -26.25,10.62 | -26.25,10.62 -26.25,11.88 Q3.3 -26.88,11.88 -27.5,11.88 -31.88,16.25 -44.38,16.25 X1.1 | 141.88,-45 140,-46.88 Q6.2 | 141.88,-45 161.25,-45 v161.88,-45.62 163.12,-46.88 Q8.2 | C3.2 18.12,-42.5 18.12,-48.12 C4.2 17.5,-48.75 v17.5,-50.62 17.5,-86.25 16.88,-86.25 X7.3 | 104.38,-28.75 104.38,-19.38 92.5,-19.38 90,-16.88 X2.2 | 104.38,-28.75 104.38,-30.62 Q4.2 | C2.2 18.12,-25 18.12,-20.62 C1.2 18.12,-20 18.75,-19.38 51.25,-19.38 55,-15.62 55,-12.5 | 55,-12.5 53.75,-12.5 C9.- 53.12,-12.5 50,-12.5 C8.2 49.38,-12.5 45,-12.5 C7.2 44.38,-12.5 38.12,-12.5 C6.- | 55,-12.5 60,-12.5 60.62,-13.12 Q1.2 | 141.88,-45 141.88,-39.38 122.5,-39.38 111.88,-28.75 104.38,-28.75
  Bottom 0.4: IC3.10 96.88,23.12 IC3.10 | 99.38,9.38 X3.L49 | 99.38,9.38 X3.L49 | 99.38,9.38 99.38,11.25 X3.L50 | 99.38,9.38 X3.L49 | X3.L50 99.38,11.88 X3.L50 | 98.75,20 98.75,11.88 X3.L50 | 98.75,20 98.75,20.62 96.88,22.5 IC3.10 | 99.38,60 X3.R49 | 99.38,60 X3.R49 | 99.38,60 99.38,61.88 X3.R50 | 99.38,60 X3.R49 | X3.R50 99.38,62.5 X3.R50 | 97.5,45 98.75,46.25 98.75,59.38 X3.R49 | 97.5,45 96.25,43.75 H1.1 | v98.12,20 98.75,20 | v101.25,23.12 101.25,41.25 97.5,45 | 67.5,23.12 IC2.10 | 67.5,23.12 IC2.10 | 68.75,24.38 70.62,26.25 72.5,26.25 75.62,29.38 75.62,30 IC3.19 | 68.75,24.38 67.5,23.12 | 67.5,23.12 IC2.10 | 68.75,24.38 68.75,25.62 | 68.75,25.62 68.75,41.88 61.25,49.38 60,49.38 58.75,48.12 58.75,43.75 H1.13 | 38.12,60 X3.R1 | 38.12,60 X3.R1 | 38.12,60 38.12,61.88 X3.R2 | 38.12,60 X3.R1 | X3.R2 38.12,62.5 X3.R2 | X3.L23 66.25,9.38 X3.L23 | X3.L5 43.75,9.38 X3.L5 | 38.12,9.38 X3.L1 | 38.12,9.38 X3.L1 | 38.12,9.38 38.12,11.25 X3.L2 | 38.12,9.38 X3.L1 | X3.L5 43.12,8.75 41.25,6.88 38.12,6.88 38.12,8.75 X3.L1 | v60.62,3.75 65.62,8.75 X3.L23 | v55.62,3.75 43.75,3.75 43.75,8.75 X3.L5 | 38.12,11.88 X3.L2 | 38.12,11.88 X3.L2 | v46.25,26.25 46.25,29.38 46.88,30 IC2.19 | 38.12,25 v38.75,25.62 | 38.12,11.88 38.12,25 | 38.12,11.88 X3.L2 | 38.12,25 38.12,29.38 | 38.12,29.38 38.12,59.38 X3.R1 | v63.75,25.62 68.75,25.62 | 38.12,29.38 34.38,33.12 34.38,65 96.25,65 98.75,62.5 X3.R50 | -29.38,60 -30.62,61.25 -30.62,74.38 JP2.1 | -29.38,60 -28.12,60 IC1.GND -29.38,60 | -33.12,-14.38 -36.25,-17.5 X6.1 | -33.12,-14.38 -23.12,-14.38 -23.12,-13.12 C10.- -22.5,-13.12 -15.62,-13.12 -15.62,-17.5 X4.1 -15,-18.12 v17.5,-50.62 | -33.12,-14.38 -33.12,5 -44.38,16.25 X1.1 -45,16.88 -47.5,19.38 -47.5,41.88 -29.38,60
  Bottom 0.4: C12.- 188.75,-70 183.12,-70 C11.- 182.5,-70 161.88,-49.38 v161.88,-45.62 | 23.75,-89.38 18.75,-89.38 17.5,-88.12 17.5,-87.5 16.88,-86.88 X7.3 | 23.75,-89.38 23.75,-86.88 X8.3 | 29.38,-89.38 31.25,-87.5 31.25,-86.88 X9.3 31.88,-86.25 32.5,-85.62 32.5,-16.25 33.75,-15 33.75,-12.5 | 23.75,-89.38 29.38,-89.38 | 29.38,-89.38 36.88,-89.38 38.75,-87.5 38.75,-86.88 X10.3 | 33.75,-12.5 37.5,-12.5 C6.- | 33.75,-12.5 31.88,-12.5 C5.- | C9.- 53.75,-13.12 55,-14.38 55,-18.75 71.88,-18.75 X5.2 72.5,-19.38 72.5,-21.88 85.62,-21.88 89.38,-18.12 89.38,-17.5 90,-16.88 X2.2
IN_!CE  (via drill 0.8)
  Top 0.4: v83.12,16.25 82.5,16.88 v55.62,16.88
  Bottom 0.4: v83.12,16.25 83.12,12.5 83.75,11.88 X3.L38 | v55.62,16.88 55,17.5 55,22.5 IC2.5
IN_!RD  (via drill 0.8)
  Top 0.4: v79.38,6.88 37.5,6.88 36.25,8.12 36.25,13.75 v42.5,13.75
  Bottom 0.4: v79.38,6.88 81.25,8.75 X3.L35 | v42.5,13.75 46.88,18.12 46.88,22.5 IC2.2
IN_!RST  (via drill 0.8)
  Top 0.4: v105,44.38 98.75,50.62 v46.88,50.62 | v51.25,18.75 v45,18.75
  Bottom 0.4: v105,44.38 105,5.62 87.5,5.62 84.38,8.75 X3.L37 | v46.88,50.62 39.38,43.12 39.38,33.12 42.5,30 42.5,21.25 v45,18.75 | v51.25,18.75 51.88,19.38 51.88,22.5 IC2.4
IN_!WR  (via drill 0.8)
  Top 0.4: v81.25,15 80.62,15.62 56.88,15.62 56.25,15 v54.38,15
  Bottom 0.4: v81.25,15 81.25,11.88 X3.L36 | v54.38,15 49.38,15 49.38,22.5 IC2.3
IN_A0
  Bottom 0.4: X3.L22 63.12,11.88 60,15 60,22.5 IC2.7
IN_A1  (via drill 0.8)
  Top 0.4: v36.25,25.62 38.75,28.12 47.5,28.12 v48.12,27.5
  Bottom 0.4: v36.25,25.62 36.25,1.25 55.62,1.25 63.12,8.75 X3.L21 | v48.12,27.5 61.88,27.5 61.88,23.12 IC2.8
IN_A2
  Bottom 0.4: X3.L24 65.62,11.88 65,12.5 65,22.5 IC2.9
IN_BL  (1 unrouted)
IN_BUZZ  (1 unrouted)
IN_C/D  (via drill 0.8)
  Top 0.4: v100.62,18.75 100,18.12 96.88,18.12 v96.25,18.75 | v85,13.75 84.38,13.12 59.38,13.12 v58.75,13.75
  Bottom 0.4: v100.62,18.75 100.62,6.88 88.75,6.88 86.88,8.75 X3.L39 | v96.25,18.75 91.25,13.75 v85,13.75 | v58.75,13.75 57.5,15 57.5,22.5 IC2.6
IN_D0
  Bottom 0.4: X3.L26 68.75,11.88 75,18.12 75,21.25 75.62,21.88 75.62,22.5 IC3.2
IN_D1  (via drill 0.8)
  Top 0.4: v66.88,5 66.25,5.62 37.5,5.62 35,8.12 35,20.62 76.25,20.62 v76.88,20
  Bottom 0.4: v66.88,5 70.62,8.75 X3.L27 | v76.88,20 78.12,21.25 78.12,22.5 IC3.3
IN_D2
  Bottom 0.4: X3.L28 71.25,11.88 81.25,21.88 81.25,22.5 IC3.4
IN_D3  (via drill 0.8)
  Top 0.4: v96.25,2.5 101.88,8.12 101.88,16.88 91.25,16.88 89.38,18.75 78.12,18.75 77.5,18.12 73.75,18.12 v73.12,18.75
  Bottom 0.4: v96.25,2.5 76.25,2.5 74.38,4.38 74.38,8.12 73.75,8.75 X3.L29 | v73.12,18.75 71.88,20 71.88,24.38 75,27.5 83.75,27.5 83.75,23.12 IC3.5
IN_D4
  Bottom 0.4: X3.L30 73.75,11.88 82.5,20.62 86.25,20.62 86.25,22.5 IC3.6
IN_D5  (via drill 0.8)
  Top 0.4: v76.25,5 97.5,5 100.62,8.12 100.62,15.62 90,15.62 v88.75,16.88
  Bottom 0.4: v76.25,5 76.25,8.75 X3.L31 | v88.75,16.88 88.75,22.5 IC3.7
IN_D6
  Bottom 0.4: X3.L32 76.25,11.88 79.38,15 79.38,15.62 81.88,18.12 86.88,18.12 86.88,16.25 88.12,15 91.25,15 91.25,22.5 IC3.8
IN_D7
  Bottom 0.4: X3.L33 78.12,8.75 77.5,8.12 77.5,6.25 79.38,4.38 106.88,4.38 106.88,45 105.62,46.25 103.12,46.25 103.12,22.5 101.88,21.25 99.38,21.25 99.38,23.12 96.88,25.62 94.38,25.62 94.38,23.12 IC3.9
IN_LED  (1 unrouted)
IN_OUT1  (1 unrouted)
IN_OUT2  (1 unrouted)
LED  (1 unrouted)
  Top 0.4: 92.5,-31.25 92.5,-32.5 Q5.8 | 92.5,-31.25 Q5.7 92.5,-31.25 | 92.5,-30 92.5,-28.75 Q5.5 | 92.5,-30 Q5.6 92.5,-30 | 92.5,-30 92.5,-31.25
LED1
  Top 0.4: -38.12,-6.88 -38.12,-8.12 | -38.12,-8.12 Q7.8 -38.12,-8.12 | -38.12,-6.88 Q7.7 -38.12,-6.88 | -38.12,-5.62 -38.12,-4.38 Q7.5 | -38.12,-5.62 Q7.6 -38.12,-5.62 | -38.12,-5.62 -38.12,-6.88 | -38.12,-8.12 -31.88,-14.38 -31.88,-17.5 X6.2
LED2  (via drill 0.8)
  Top 0.4: -30.62,1.88 -30.62,0.62 Q9.8 -30,0.62 v-28.12,0.62 | -30.62,1.88 Q9.7 -30.62,1.88 | -30.62,3.12 -30.62,4.38 Q9.5 | -30.62,3.12 Q9.6 -30.62,3.12 | -30.62,3.12 -30.62,1.88
  Bottom 0.4: v-28.12,0.62 -10.62,-16.88 -10.62,-17.5 X4.2
N$1  (via drill 0.8)
  Top 0.4: v12.5,-29.38 13.12,-28.75 16.25,-28.75 17.5,-30 R1.2 | v-38.75,44.38 -41.25,46.88 SJ1.2
  Bottom 0.4: v12.5,-29.38 -22.5,5.62 -22.5,28.12 v-38.75,44.38
N$2
  Top 0.4: R2.2 17.5,-35 15,-32.5 -25.62,-32.5 -48.75,-9.38 -48.75,79.38 -43.12,79.38 -42.5,78.75 -42.5,77.5 SJ2.2
N$3
  Top 0.4: R3.2 67.5,-21.88 69.38,-23.75 69.38,-27.5 -25.62,-27.5 -35,-18.12 -35,-12.5 -36.25,-12.5 -43.75,-5 -43.75,6.88 -45.62,6.88 Q2.4
N$4
  Top 0.4: Q1.3 58.75,-14.38 58.75,-23.75 66.88,-23.75 R3.1
N$5  (via drill 0.8)
  Top 0.4: -50.62,4.38 -50.62,3.12 Q2.8 | -50.62,4.38 Q2.7 -50.62,4.38 | -50.62,6.88 -50.62,5.62 | -50.62,5.62 Q2.6 -50.62,5.62 | -50.62,6.88 Q2.5 -50.62,6.88 | -50.62,5.62 -50.62,4.38 | v-50.62,8.75 -50.62,6.88
  Bottom 0.4: v-50.62,8.75 -48.75,10.62 -48.75,68.12 -29.38,87.5 R4.1
N$6
  Top 0.4: Q1.1 61.25,-15 66.25,-20 70,-20 80,-30 81.25,-30 R5.2
N$7
  Top 0.4: R7.2 102.5,-21.88 98.12,-26.25 98.12,-28.75 Q5.4
N$8
  Top 0.4: R6.2 86.25,-30 76.88,-20.62 76.88,-10.62 38.12,-10.62 31.88,-16.88 -5.62,-16.88 -9.38,-20.62 -23.12,-20.62 -36.25,-7.5 -36.25,8.12 -25.62,8.12 -24.38,9.38 -24.38,13.12 -26.25,13.12 Q3.4
N$9
  Top 0.4: Q4.3 101.88,-31.88 101.88,-24.38 102.5,-24.38 R7.1
N$10
  Top 0.4: R9.2 138.12,-37.5 105,-4.38 -32.5,-4.38 Q7.4
N$11
  Top 0.4: Q4.1 104.38,-32.5 106.25,-30.62 110,-30.62 R8.2
N$12
  Top 0.4: Q6.3 137.5,-48.12 137.5,-41.25 138.12,-41.25 R9.1
N$13
  Top 0.4: Q6.1 140,-48.75 143.75,-48.75 145.62,-46.88 R10.2
N$14
  Top 0.4: R11.2 162.5,-37.5 126.25,-1.25 -18.12,-1.25 -23.75,4.38 -25,4.38 Q9.4
N$15
  Top 0.4: Q8.3 161.88,-48.75 161.88,-51.25 171.25,-51.25 171.88,-50.62 171.88,-41.25 163.12,-41.25 R11.1
N$16
  Top 0.4: Q8.1 163.75,-48.75 168.12,-48.75 170,-46.88 R12.2
N$20  (1 unrouted)
N$21  (1 unrouted)
N$22  (1 unrouted)
N$23  (1 unrouted)
N$24  (1 unrouted)
N$25  (1 unrouted)
N$26  (1 unrouted)
N$27  (1 unrouted)
VDD  (via drill 0.8)
  Top 0.4: v40,30 v36.25,33.75
  Bottom 0.4: X3.L3 40.62,9.38 40.62,11.25 X3.L4 40.62,11.88 40.62,29.38 v40,30 | v36.25,33.75 36.25,63.75 61.88,63.75 63.12,62.5 X3.R22